# EAGLE schematic WeightAlarm (EAGLE 9.6.2)
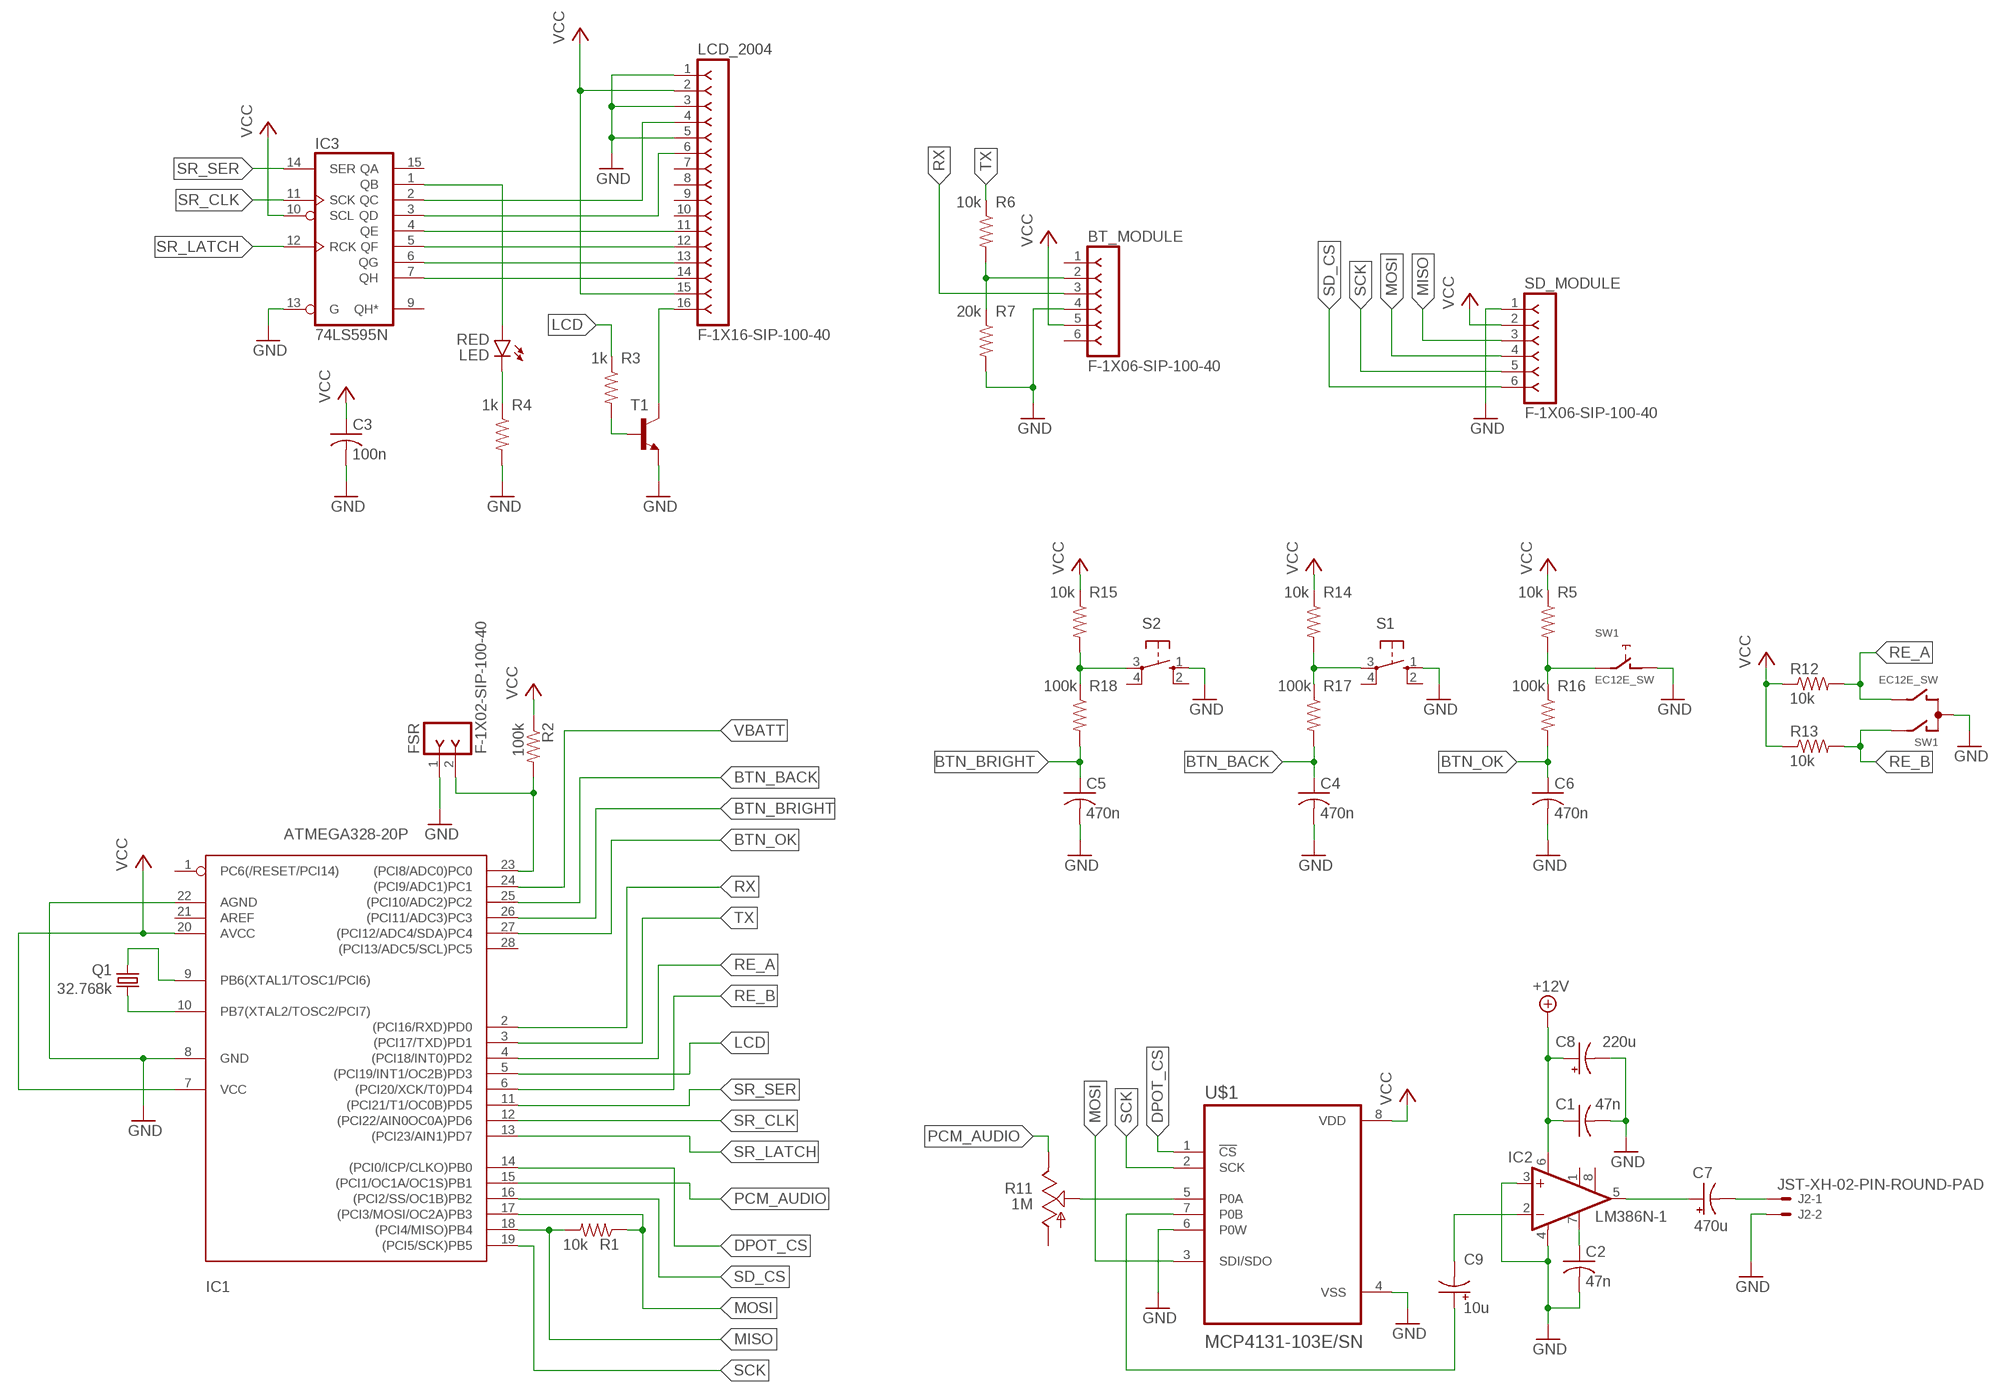
[diagram p0: schematic, sheet 1]

## Parts
BT_MODULE  F-1X06-SIP-100-40  [SIP-100-06-40]
C1  47n  C-US025-030X050  [C025-030X050]
C2  47n  C-US025-030X050  [C025-030X050]
C3  100n  C-US025-030X050  [C025-030X050]
C4  470n  C-US025-030X050  [C025-030X050]
C5  470n  C-US025-030X050  [C025-030X050]
C6  470n  C-US025-030X050  [C025-030X050]
C7  470u  CPOL-USE2.5-7  [E2,5-7]
C8  220u  CPOL-USE2.5-6  [E2,5-6]
C9  10u  CPOL-USE2.5-5  [E2,5-5]
FSR  F-1X02-SIP-100-40  [SIP-100-02-40]
IC1  ATMEGA328-20P  [DIL28-3]
IC2  LM386N-1  [DIL08]
IC3  74LS595N  [DIL16]
J2  JST-XH-02-PIN-ROUND-PAD  [JST-XH-02-PACKAGE-ROUND-PAD]
LCD_2004  F-1X16-SIP-100-40  [SIP-100-16-40]
LED  RED  LED5MM  [LED5MM]
Q1  32.768k  CRYSTALTC26V  [TC26V]
R1  10k  R-US_0207/7  [0207/7]
R2  100k  R-US_0207/7  [0207/7]
R3  1k  R-US_0207/7  [0207/7]
R4  1k  R-US_0207/7  [0207/7]
R5  10k  R-US_0207/7  [0207/7]
R6  10k  R-US_0207/7  [0207/7]
R7  20k  R-US_0207/7  [0207/7]
R11  1M  TRIM_US-B25P  [B25P]
R12  10k  R-US_0207/7  [0207/7]
R13  10k  R-US_0207/7  [0207/7]
R14  10k  R-US_0207/7  [0207/7]
R15  10k  R-US_0207/7  [0207/7]
R16  100k  R-US_0207/7  [0207/7]
R17  100k  R-US_0207/7  [0207/7]
R18  100k  R-US_0207/7  [0207/7]
S1  10-XX  [B3F-10XX]
S2  10-XX  [B3F-10XX]
SD_MODULE  F-1X06-SIP-100-40  [SIP-100-06-40]
SW1  EC12E_SW  [ALPS_EC12E_SW]
T1  -NPN-TO92-EBC  [TO92-EBC]
U$1  MCP4131-103E/SN  [SOIC127P599X175-8N]

## Nets
+12V: C1.1 C8.+ IC2.6(VS)
BTN_BACK: C4.1 IC1.25((PCI10/ADC2)PC2) R17.2
BTN_BRIGHT: C5.1 IC1.26((PCI11/ADC3)PC3) R18.2
BTN_OK: C6.1 IC1.27((PCI12/ADC4/SDA)PC4) R16.2
DPOT_CS: IC1.14((PCI0/ICP/CLKO)PB0) U$1.1(!CS)
GND: BT_MODULE.4 C1.2 C2.2 C3.2 C4.2 C5.2 C6.2 C8.- FSR.1 IC1.8(GND) IC1.22(AGND) IC2.3(+IN) IC2.4(GND) IC3.13(G) J2.2 LCD_2004.1 LCD_2004.3 LCD_2004.5 R4.2 R7.2 S1.1(S) S2.1(S) SD_MODULE.1 SW1.C SW1.D T1.E U$1.4(VSS) U$1.6(P0W)
LCD: IC1.5((PCI19/INT1/OC2B)PD3) R3.1
MISO: IC1.18((PCI4/MISO)PB4) R1.2 SD_MODULE.3
MOSI: IC1.17((PCI3/MOSI/OC2A)PB3) R1.1 SD_MODULE.4 U$1.3(SDI/SDO)
N$1: R3.2 T1.B
N$2: IC1.9(PB6(XTAL1/TOSC1/PCI6)) Q1.2
N$3: IC1.10(PB7(XTAL2/TOSC2/PCI7)) Q1.1
N$4: R5.2 R16.1 SW1.E
N$5: IC3.2(QC) LCD_2004.4
N$6: R14.2 R17.1 S1.3(P)
N$7: LED.K(C) R4.1
N$8: R15.2 R18.1 S2.3(P)
N$9: LCD_2004.16 T1.C
N$10: IC3.1(QB) LED.A
N$11: IC3.7(QH) LCD_2004.14
N$12: IC3.6(QG) LCD_2004.13
N$13: IC3.5(QF) LCD_2004.12
N$14: IC3.4(QE) LCD_2004.11
N$15: IC3.3(QD) LCD_2004.6
N$16: C7.+ IC2.5(OUT)
N$17: C7.- J2.1
N$18: FSR.2 IC1.23((PCI8/ADC0)PC0) R2.2
N$19: C9.- IC2.2(-IN)
N$20: C9.+ U$1.7(P0B)
N$21: C2.1 IC2.7(BYPASS)
N$29: R11.S U$1.5(P0A)
PCM_AUDIO: IC1.15((PCI1/OC1A/OC1S)PB1) R11.E
RE_A: IC1.4((PCI18/INT0)PD2) R12.2 SW1.B
RE_B: IC1.6((PCI20/XCK/T0)PD4) R13.2 SW1.A
RX: BT_MODULE.3 IC1.2((PCI16/RXD)PD0)
SCK: IC1.19((PCI5/SCK)PB5) SD_MODULE.5 U$1.2(SCK)
SD_CS: IC1.16((PCI2/SS/OC1B)PB2) SD_MODULE.6
SR_CLK: IC1.12((PCI22/AIN0OC0A)PD6) IC3.11(SCK)
SR_LATCH: IC1.13((PCI23/AIN1)PD7) IC3.12(RCK)
SR_SER: IC1.11((PCI21/T1/OC0B)PD5) IC3.14(SER)
TX: BT_MODULE.2 IC1.3((PCI17/TXD)PD1) R6.1 R6.2 R7.1
VBATT: IC1.24((PCI9/ADC1)PC1)
VCC: BT_MODULE.5 C3.1 IC1.7(VCC) IC1.20(AVCC) IC3.10(SCL) LCD_2004.2 LCD_2004.15 R2.1 R5.1 R12.1 R13.1 R14.1 R15.1 SD_MODULE.2 U$1.8(VDD)
Unconnected: BT_MODULE.1 BT_MODULE.6 IC1.1(PC6(/RESET/PCI14)) IC1.21(AREF) IC1.28((PCI13/ADC5/SCL)PC5) IC2.1(GAIN) IC2.8(GAIN) IC3.9(QH*) IC3.15(QA) LCD_2004.7 LCD_2004.8 LCD_2004.9 LCD_2004.10 R11.A S1.2(S1) S1.4(P1) S2.2(S1) S2.4(P1) SW1.GND1(G) SW1.GND2(G)

## Power pins joined to a net without a drawn wire
GND: IC3.8(GND)
VCC: IC3.16(VCC)

## Library data of the parts
BT_MODULE SD_MODULE = con-headers-jp:F-1X06-: FEMALE HEADER
C1-C6 = rcl:C-US: CAPACITOR, American symbol; SPICEPREFIX: C
C7-C9 = rcl:CPOL-US: POLARIZED CAPACITOR, American symbol; SPICEPREFIX: C
FSR = con-headers-jp:F-1X02-: FEMALE HEADER
IC1 = atmega328:ATMEGA328*P: MICROCONTROLLER 32 kBytes FLASH 2 kBytes SRAM 1 kBytes EEPROM USART 8-channel 10 bit ADC
IC2 = linear:LM386?-*: Low Voltage Audio Power Amplifier Source: http://cache.national.com/ds/LM/LM386.pdf
IC3 = 74xx-us:74*595: 8-bit SHIFT REGISTER, output latch; SPICEPREFIX: X
J2 = Rembrandt Electronics - JST XH Connectors v1-0:JST-XH-02-PIN: JST XH Connector 2 Pin Wire to board connector. Pitch: 2,54 mm, (0.100") Number of pins: 2 Created by Rembrandt Electronics www.rembrandtelectronics.com
LCD_2004 = con-headers-jp:F-1X16-: FEMALE HEADER; SPICEPREFIX: X
LED = led:LED: LED OSRAM: - CHIPLED LG R971, LG N971, LY N971, LG Q971, LY Q971, LO R971, LY R971 LH N974, LH R974 LS Q976, LO Q976, LY Q976 LO Q996 - Hyper CHIPLED LW Q18S LB Q993, LB Q99A, LB R99A - SideLED LS A670, LO A670, LY A670, LG A670, LP A670 LB A673, LV A673, LT A673, LW A673 LH A674 LY A675 LS A676, LA A676, LO A676, LY A676, LW A676 LS A679, LY A679, LG A679 - Hyper Micro SIDELED® LS Y876, LA Y876, LO Y876, LY Y876 LT Y87S - SmartLED LW L88C, LW L88S LB L89C, LB L89S, LG L890 LS L89K, LO L89K, LY L89K LS L896, LA L896, LO L896, LY L896 - TOPLED LS T670, LO T670, LY T670, LG T670, LP T670 LSG T670, LSP T670, LSY T670, LOP T670, LYG T670 LG T671, LOG T671, LSG T671 LB T673, LV T673, LT T673, LW T673 LH T674 LS T676, LA T676, LO T676, LY T676, LB T676, LH T676, LSB T676, LW T676 LB T67C, LV T67C, LT T67C, LS T67K, LO T67K, LY T67K, LW E67C LS E67B, LA E67B, LO E67B, LY E67B, LB E67C, LV E67C, LT E67C LW T67C LS T679, LY T679, LG T679 LS T770, LO T770, LY T770, LG T770, LP T770 LB T773, LV T773, LT T773, LW T773 LH T774 LS E675, LA E675, LY E675, LS T675 LS T776, LA T776, LO T776, LY T776, LB T776 LHGB T686 LT T68C, LB T68C - Hyper Mini TOPLED® LB M676 - Mini TOPLED Santana® LG M470 LS M47K, LO M47K, LY M47K Source: http://www.osram.convergy.de LUXEON: - LUMILED® LXK2-PW12-R00, LXK2-PW12-S00, LXK2-PW14-U00, LXK2-PW14-V00 LXK2-PM12-R00, LXK2-PM12-S00, LXK2-PM14-U00 LXK2-PE12-Q00, LXK2-PE12-R00, LXK2-PE12-S00, LXK2-PE14-T00, LXK2-PE14-U00 LXK2-PB12-K00, LXK2-PB12-L00, LXK2-PB12-M00, LXK2-PB14-N00, LXK2-PB14-P00, LXK2-PB14-Q00 LXK2-PR12-L00, LXK2-PR12-M00, LXK2-PR14-Q00, LXK2-PR14-R00 LXK2-PD12-Q00, LXK2-PD12-R00, LXK2-PD12-S00 LXK2-PH12-R00, LXK2-PH12-S00 LXK2-PL12-P00, LXK2-PL12-Q00, LXK2-PL12-R00 Source: www.luxeon.com KINGBRIGHT: KA-3528ASYC Source: www.kingbright.com; SPICEPREFIX: L
Q1 = crystal:CRYSTAL: CRYSTAL; OC_FARNELL: unknown; OC_NEWARK: unknown
R1-R7 R12-R18 = rcl:R-US_: RESISTOR, American symbol; SPICEPREFIX: R
R11 = pot:TRIM_US-: POTENTIOMETER
S1 S2 = switch-omron:10-XX: OMRON SWITCH; MPN: B3F-1000; OC_FARNELL: 176432; OC_NEWARK: 36M3542
SW1 = switch-alps:EC12E_SW: ALPS rotary Encoder EC12E series with switch; MPN: EC12E2424407; OC_FARNELL: 1520813; OC_NEWARK: 74M1068
T1 = transistor:*-NPN-: NPN Transistror BF959 corrected 2008.03.06; SPICEPREFIX: J
U$1 = MCP4131-103E_SN:MCP4131-103E/SN: Check availability <https://pricing.snapeda.com/parts/MCP4131-103E/SN/Microchip/view-part?ref=eda>; AVAILABILITY: In Stock; DESCRIPTION: Digital Potentiometer 10k Ohm 1 Circuit 129 Taps SPI Interface 8-SOIC; MF: Microchip; MP: MCP4131-103E/SN; PACKAGE: SOIC-8 Microchip; PRICE: None; PURCHASE-URL: https://pricing.snapeda.com/search/part/MCP4131-103E/SN/?ref=eda